# Altium project LED Project.PrjPcb
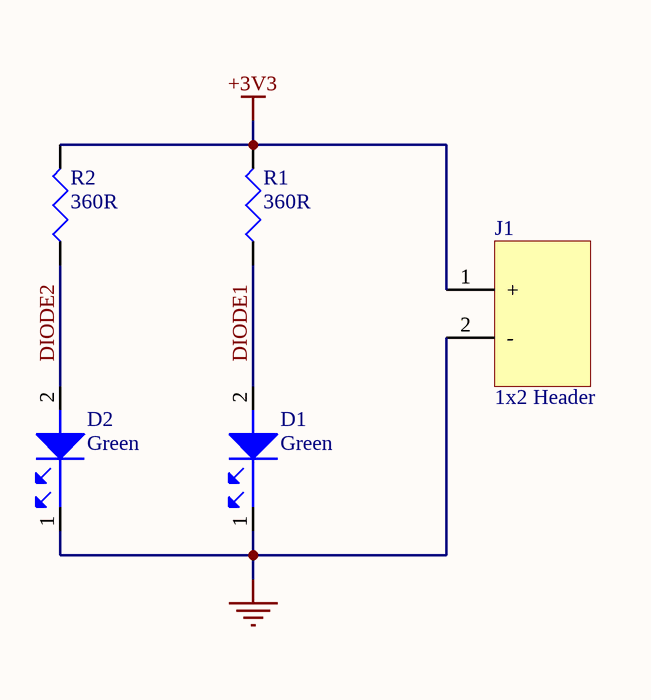
[diagram p0: LED Schematic.SchDoc]
1 sheet, 5 parts. Net scope: global (net labels, ports and power ports of the same name join across sheets).
Board file: LED Project PCB.PcbDoc

## Sheet LED Schematic.SchDoc
size A3; SheetNumber: 1; SheetTotal: 1

### Parts
D1  Green  [LED1540G]
D2  Green  [LED1540G]
J1  1x2 Header  [HDR1X2]
R1  360R  [R0805]
R2  360R  [R0805]

### Nets
+3V3: J1.1(+) R1.2 R2.2
GND: D1.1 D2.1 J1.2(-)
DIODE1: D1.2 R1.1
DIODE2: D2.2 R2.1

### Library data of the parts
D1 D2 = LNJ115W8ARA: Led Green/orange TSS-2 Type SMD; Manufacturer: Panasonic; Color: Green,Orange,Yellow; Luminous Intensity: 1mcd; Test Current: 10mA; Lens Style: Rectangular; Dominant Wavelength: 630nm; Forward Voltage: 1.93V; Category1: Optoelectronics; Supplier 1: Digikey; Supplier Part Number 1: P11142CT-ND; Manufacturer Part Number: LNJ115W8ARA; RoHS: Yes; Category: LEDs; Stock 1: 23540; Pricing 1: 1=0.48, 10=0.316, 100=0.2264, 500=0.18998, 1000=0.17847 (USD); Mount: Surface Mount; Case/Package: 0605; Number of Pins: 4; Case Code (Metric): 1613; Case Code (Imperial): 0605; Min Operating Temperature: -30°C; Max Operating Temperature: 85°C; Package Quantity: 1; Packaging: Cut Tape; Wavelength: 630nm; Length: 1.6mm; RoHS Compliant: Yes; ComponentLink1URL: https://datasheet.ciiva.com/1246/340491-1246153.pdf?src-supplier=Element14; ComponentLink1Description: https://datasheet.ciiva.com/1246/340491-1246153.pdf?src-supplier=Element14; ComponentLink2URL: https://datasheet.ciiva.com/1249/340491-1249195.pdf?src-supplier=Farnell; ComponentLink2Description: https://datasheet.ciiva.com/1249/340491-1249195.pdf?src-supplier=Farnell; Width: 1.25mm; Height: 0.55mm; Reach SVHC Compliant: Yes; Lead Free: Lead Free
J1 = 0022292021: KK 254 Wire-to-Board Header, Vertical, with Friction Lock, 2 Circuits, Gold (Au) Plating; Manufacturer: Molex; Supplier 1: Mouser; Manufacturer Part Number: 0022292021; RoHS: No; Stock 1: 18345; Pricing 1: 1=0.45, 10=0.375, 50=0.375, 100=0.309, 1000=0.262, 10000=0.214 (USD); ComponentLink1URL: https://datasheet.octopart.com/22-29-2021-Molex-datasheet-33002381.pdf?src-supplier=Newark; ComponentLink1Description: https://datasheet.octopart.com/22-29-2021-Molex-datasheet-33002381.pdf?src-supplier=Newark; ComponentLink2URL: https://datasheet.octopart.com/22-29-2021-Molex-datasheet-7277451.pdf?src-supplier=Jameco; ComponentLink2Description: https://datasheet.octopart.com/22-29-2021-Molex-datasheet-7277451.pdf?src-supplier=Jameco; ComponentLink3URL: https://datasheet.octopart.com/22-29-2021-Molex-datasheet-17586671.pdf?src-supplier=TME; ComponentLink3Description: https://datasheet.octopart.com/22-29-2021-Molex-datasheet-17586671.pdf?src-supplier=TME; Supplier Part Number 1: 538-22-29-2021; Category: Connectors
R1 R2 = CRCW0805360RFKEA: SMD Chip Resistor, 360 Ohm, ± 1%, 125 mW, 0805 [2012 Metric], Thick Film, General Purpose; Manufacturer: Vishay; Supplier 1: Mouser; Supplier Part Number 1: 71-CRCW0805360RFKEA; Manufacturer Part Number: CRCW0805360RFKEA; RoHS: Yes; Stock 1: 13295; Pricing 1: 1=0.1, 10=0.033, 50=0.033, 100=0.015, 1000=0.011, 10000=0.007 (USD); Reach SVHC Compliant: 4187SVHC; ComponentLink1URL: https://datasheet.ciiva.com/2467/dcrcwe3-2467773.pdf?src-supplier=Digikey; ComponentLink1Description: https://datasheet.ciiva.com/2467/dcrcwe3-2467773.pdf?src-supplier=Digikey; Category: Resistors

## Assembly variants
LED2 Not Fitted: not fitted D2 R2